# Altium schematic sheet Mainboard_Geneva_Interface.SchDoc
size A
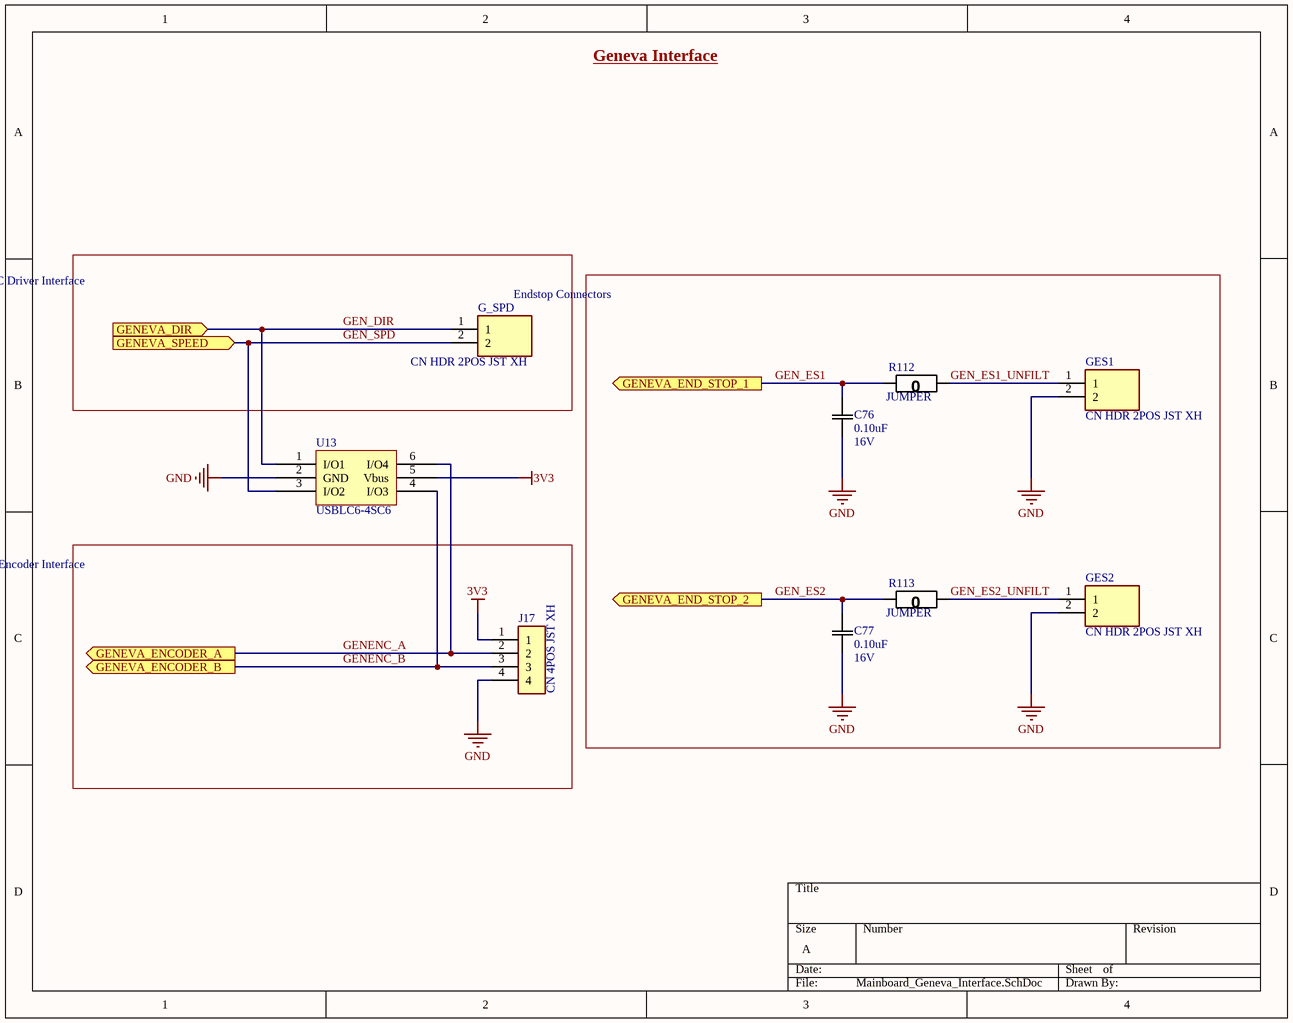
[diagram p0: Mainboard_Geneva_Interface.SchDoc]

## Parts
C76  Rating: 16V  [0603]  (hidden comment: 0.10uF)
C77  Rating: 16V  [0603]  (hidden comment: 0.10uF)
G_SPD  CN HDR 2POS JST XH  [JST_B2B-XH-A(LF)(SN)]
GES1  CN HDR 2POS JST XH  [JST_B2B-XH-A(LF)(SN)]
GES2  CN HDR 2POS JST XH  [JST_B2B-XH-A(LF)(SN)]
J17  CN 4POS JST XH  [JST_B4B-XH-A(LF)(SN)]
R112  JUMPER  [0603]
R113  JUMPER  [0603]
U13  USBLC6-4SC6  [SOT23-6L]

## Blocks framed on the sheet
DC Driver Interface: G_SPD
Endstop Connectors: C76 C77 GES1 GES2 R112 R113
Encoder Interface: J17

## Ports
GENEVA_DIR (in), GENEVA_ENCODER_A (out), GENEVA_ENCODER_B (out), GENEVA_END_STOP_1 (out), GENEVA_END_STOP_2 (out), GENEVA_SPEED (in)

## Nets
3V3: J17.1 U13.5(Vbus)
GND: C76.2(C2) C77.2(C2) GES1.2 GES2.2 J17.4 U13.2(GND)
GEN_DIR: G_SPD.1 U13.1(I/O1) ; port GENEVA_DIR
GEN_ES1: C76.1(C1) R112.2(R2) ; port GENEVA_END_STOP_1
GEN_ES1_UNFILT: GES1.1 R112.1(R1)
GEN_ES2: C77.1(C1) R113.2(R2) ; port GENEVA_END_STOP_2
GEN_ES2_UNFILT: GES2.1 R113.1(R1)
GEN_SPD: G_SPD.2 U13.3(I/O2) ; port GENEVA_SPEED
GENENC_A: J17.2 U13.6(I/O4) ; port GENEVA_ENCODER_A
GENENC_B: J17.3 U13.4(I/O3) ; port GENEVA_ENCODER_B

## Notes on the sheet
- Geneva Interface

## Library data of the parts
C76 C77 = CAP 0.10uF 16V: CAP CER 0.10UF 16V X5R 0603/0805; Tolerance: 10%; Package: 0603/0805; Temperature Coefficient: X5R; Operating Temperature: -55°C ~ 85°C; Value: 0.10uF
G_SPD GES1 GES2 = CN HDR 2POS JST XH: Connector Header Through Hole 2 position 0.098 _2.50mm_ / JST XH; MP: B2B-XH-A_LF__SN_; MF: JST Sales; Price: None; Package: None; Value: *; Availability: Unavailable; SnapEDA_Link: https://www.snapeda.com/parts/B2B-XH-A%28LF%29%28SN%29/JST%20Sales%20America%20Inc./view-part/492310/?ref=snap
J17 = CN 4POS JST XH: Connector Header Through Hole 4 position 0.098 _2.50mm_ / B4B-XH-A(LF)(SN); MP: B4B-XH-A_LF__SN_; MF: JST Sales; Price: None; Package: None; Value: *; Availability: Unavailable; SnapEDA_Link: https://www.snapeda.com/parts/B4B-XH-A%28LF%29%28SN%29/JST%20Sales%20America%20Inc./view-part/447494/?ref=snap
R112 R113 = RES 0 JUMPER: RES SMD 0 OHM JUMPER GENERIC 0805; Value: 0; Package: 0805